# EAGLE design rotary_encoder_4 (EAGLE 7.7.0)
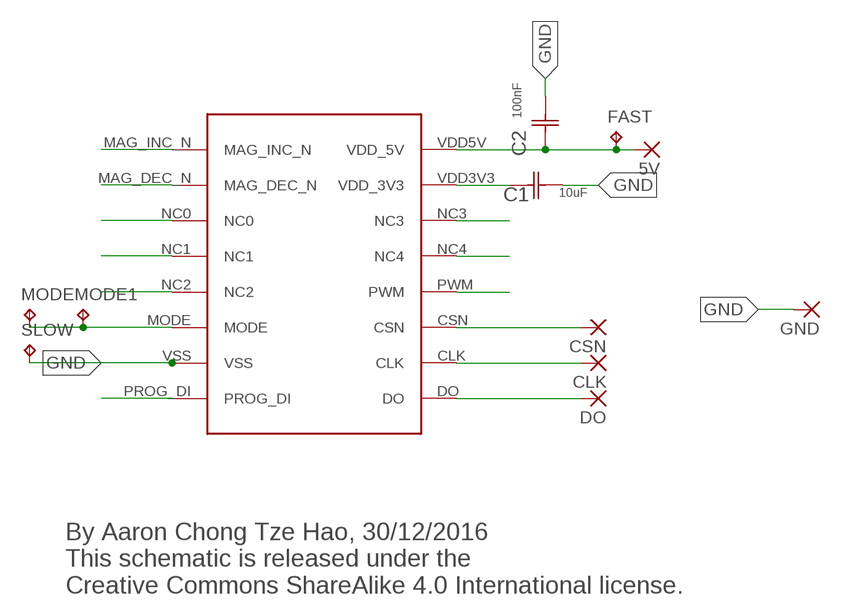
[diagram p0: schematic, sheet 1]

## Parts
5V  1,6/0,8  [1,6/0,8]
C1  10uF  CAP_0805_10UF  [CAP_0805_100NF]
C2  100nF  CAP_0805_100NF  [CAP_0805_100NF]
CLK  1,6/0,8  [1,6/0,8]
CSN  1,6/0,8  [1,6/0,8]
DO  1,6/0,8  [1,6/0,8]
FAST  TPTP10SQ  [TP10SQ]
GND  1,6/0,8  [1,6/0,8]
MODE  TPTP10SQ  [TP10SQ]
MODE1  TPTP10SQ  [TP10SQ]
SLOW  TPTP10SQ  [TP10SQ]
U$1  AS5045_ROTARY_ENCODER  [AS5045_ROTARY_ENCODER]

## Nets
5V: 5V.1(P) C2.1(C1) FAST.TP U$1.VDD5V(VDD_5V)
CLK: CLK.1(P) U$1.CLK
CSN: CSN.1(P) U$1.CSN
DO: DO.1(P) U$1.DO
GND: C1.2(C2) C2.2(C2) GND.1(P) SLOW.TP U$1.VSS
N$1: MODE1.TP MODE.TP U$1.MODE
N$2: C1.1(C1) U$1.VDD3V3(VDD_3V3)
N$3: U$1.NC3
N$4: U$1.NC4
N$5: U$1.PWM
N$9: U$1.MAG_INC_N
N$10: U$1.MAG_DEC_N
N$11: U$1.NC0
N$12: U$1.NC1
N$13: U$1.NC2
N$16: U$1.PROG_DI

## Notes on the sheet
- By Aaron Chong Tze Hao, 30/12/2016
  This schematic is released under the 
  Creative Commons ShareAlike 4.0 International license.

## Library data of the parts
5V CLK CSN DO GND = wirepad:1,6/0,8: THROUGH-HOLE PAD
C1 = cap_0805:CAP_0805_10UF: CAPACITOR, 0805; MPN: 0805F106Z100CT; OC_FARNELL: 1759421; SUPPLIER: Multicomp; TOLERANCE: -20/+80%; VOLTAGERATING: 10V
C2 = cap_0805:CAP_0805_100NF: CAPACITOR, 0805; MPN: U0805F104ZCT; OC_FARNELL: 9406409; OC_NEWARK: 38K9281; SUPPLIER: Multicomp; TOLERANCE: -20/+80%; VOLTAGERATING: 50V
FAST MODE MODE1 SLOW = testpad:TP: Test pad
U$1 = DCG_encoders:AS5045_ROTARY_ENCODER

## Board
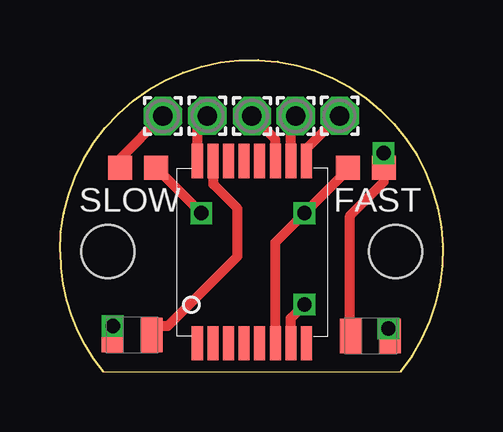
[diagram p1: board, top side]
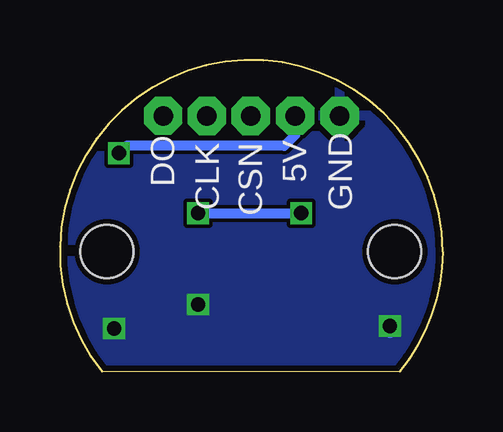
[diagram p2: board, bottom side, seen from below]

Size 15.96 x 12.98 mm. Coordinates in mm from the lower left corner, seen from the top.
Outline: 1.8,0 14.2,0 arc219 0,5 arc39 1.8,0
Copper layers (1*16): Top 0.035mm / dielectric 1.5mm / Bottom 0.035mm
Design rules "SeeedStudio_2layer_DRU_no_angle_20140221 *": minimum track width 6mil, minimum drill 12mil, track to track 6mil, track to pad 6mil, pad to pad 6mil, via to via 6mil, smd to smd 0mil, copper to edge 10mil, drill to drill 10mil, minimum pad ring 10mil, minimum via ring 6mil, stop-mask expansion 2mil, vias tented up to drill 100mil, thermal gap 10mil
Holes 2.2 mm at 2,5 14,5

### Footprints (pad centres in the part's own frame; a part is rotated, then mirrored left to right if it is on the bottom)
1,6/0,8 = drill 0.813 pad 1.6 octagon: 1 0,0
CAP_0805_100NF = smd 0.914 x 1.448: 1 -0.813,0; 2 0.813,0
TP10SQ = smd 1 x 1: TP 0,0
AS5045_ROTARY_ENCODER = smd 1.43 x 0.46: CLK 3.78,-1.59; CSN 3.78,-0.94; DO 3.78,-2.24; MAG_DEC_N -3.81,1.66; MAG_INC_N -3.81,2.31; MODE -3.81,-0.94; NC0 -3.81,1.01; NC1 -3.81,0.36; NC2 -3.81,-0.29; NC3 3.78,1.01; NC4 3.78,0.36; PROG_DI -3.81,-2.24; PWM 3.78,-0.29; VDD3V3 3.78,1.66; VDD5V 3.78,2.31; VSS -3.81,-1.59

### Placement (x,y rotation side)
5V  6.15,10.66 0 top
C1  3.01,1.53 180 top
C2  12.95,1.48 0 top
CLK  9.83,10.65 0 top
CSN  8.01,10.65 0 top
DO  11.66,10.66 0 top
FAST  13.5,8.5 0 top
GND  4.29,10.65 0 top
MODE  4,8.5 0 top
MODE1  12,8.5 0 top
SLOW  2.5,8.5 0 top
U$1  8.04,4.99 90 top

### Tracks (layer width: path | path; a pad name or v marks a point on that pad's centre or on a via)
5V  (via drill 0.6)
  Top 0.406: U$1.VDD5V 5.73,10.24 5V.1 | v13.5,9.1 FAST.TP 13.5,7.9 12.1,6.5 12.1,1.52 C2.1
  Bottom 0.406: 5V.1 6.15,9.85 6.6,9.4 13.2,9.4 v13.5,9.1
CLK
  Top 0.406: U$1.CLK 9.63,10.45 CLK.1
CSN
  Top 0.406: U$1.CSN 8.98,9.68 CSN.1
DO
  Top 0.406: U$1.DO 10.28,9.28 DO.1
GND  (via drill 0.6)
  Top 0.406: C1.2 v2.2,1.9 | C2.2 13.7,1.48 v13.7,1.8 | SLOW.TP 2.5,8.86 GND.1 | U$1.VSS 9.63,2.23 v10.2,2.8
  Bottom 0.406: v2.2,1.9 2.2,1.6 | v13.7,1.8 13.7,1.9 | v10.2,2.8 10.2,2.7
  pour Bottom: 0.2,0.1 20.4,0.1 20.4,12.4 0.2,12.4
N$1  (via drill 0.6)
  Top 0.406: MODE1.TP 12,8.4 v10.2,6.6 8.98,5.38 U$1.MODE | v5.9,6.6 MODE.TP
  Bottom 0.406: v10.2,6.6 v5.9,6.6
N$2
  Top 0.406: C1.1 3.82,1.88 3.8,1.9 4.5,1.9 7.4,4.8 7.4,6.8 6.4,7.8 6.4,8.75 U$1.VDD3V3

### Text on the board
Document: By Aaron Chong Tze Hao, 30/12/2016 / This board file is released under the / Creative Commons ShareAlike 4.0 International license.